# Altium project MAX274.PrjPcb
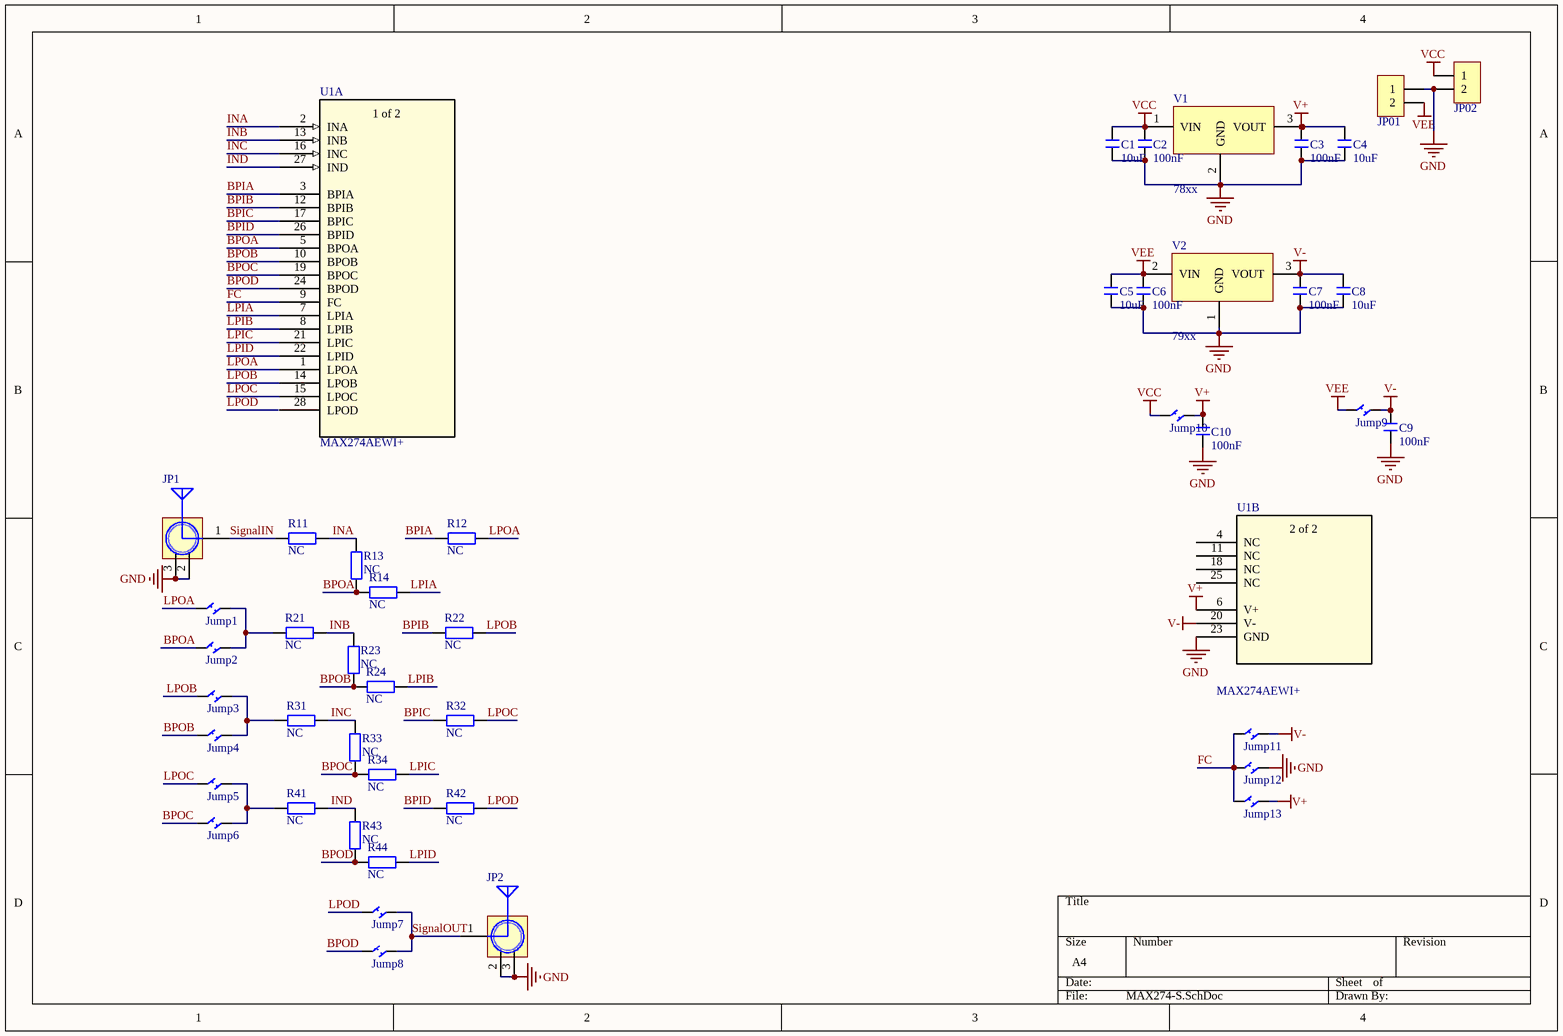
[diagram p0: MAX274-S.SchDoc]
1 sheet, 46 parts. Net scope: global (net labels, ports and power ports of the same name join across sheets).
Board file: MAX274-P.PcbDoc

## Sheet MAX274-S.SchDoc
size A4; SheetNumber: 1; SheetTotal: 1

### Parts
C1  10uF  [C 0603_L]
C2  100nF  [C 0603_L]
C3  100nF  [C 0603_L]
C4  10uF  [C 0603_L]
C5  10uF  [C 0603_L]
C6  100nF  [C 0603_L]
C7  100nF  [C 0603_L]
C8  10uF  [C 0603_L]
C9  100nF  [C 0603_L]
C10  100nF  [C 0603_L]
JP1  SMA WIFI 天线接口  [SMA-KE]  (value not drawn)
JP01  HDR-1X2  [VH3.96-LI-2P]  (value not drawn)
JP2  SMA WIFI 天线接口  [SMA-KE]  (value not drawn)
JP02  HDR-1X2  [VH3.96-LI-2P]  (value not drawn)
Jump1  JumpPad  [Jump]  (value not drawn)
Jump2  JumpPad  [Jump]  (value not drawn)
Jump3  JumpPad  [Jump]  (value not drawn)
Jump4  JumpPad  [Jump]  (value not drawn)
Jump5  JumpPad  [Jump]  (value not drawn)
Jump6  JumpPad  [Jump]  (value not drawn)
Jump7  JumpPad  [Jump]  (value not drawn)
Jump8  JumpPad  [Jump]  (value not drawn)
Jump9  JumpPad  [Jump]  (value not drawn)
Jump10  JumpPad  [Jump]  (value not drawn)
Jump11  JumpPad  [Jump]  (value not drawn)
Jump12  JumpPad  [Jump]  (value not drawn)
Jump13  JumpPad  [Jump]  (value not drawn)
R11  NC  [R 0603_L]
R12  NC  [R 0603_L]
R13  NC  [R 0603_L]
R14  NC  [R 0603_L]
R21  NC  [R 0603_L]
R22  NC  [R 0603_L]
R23  NC  [R 0603_L]
R24  NC  [R 0603_L]
R31  NC  [R 0603_L]
R32  NC  [R 0603_L]
R33  NC  [R 0603_L]
R34  NC  [R 0603_L]
R41  NC  [R 0603_L]
R42  NC  [R 0603_L]
R43  NC  [R 0603_L]
R44  NC  [R 0603_L]
U1  MAX274AEWI+  [21-0042B_28_MXM]  (parts A,B of 2)
V1  78xx  [TO252]
V2  79xx  [TO252]

### Nets
GND: C1.1 C2.1 C3.1 C4.1 C5.1 C6.1 C7.1 C8.1 C9.1 C10.1 JP01.1 JP1.2(GND) JP1.3(GND) JP2.2(GND) JP02.2 JP2.3(GND) Jump12.2 U1.23(GND) V1.2(GND) V2.1(GND)
V+: C3.2 C4.2 C10.2 Jump10.2 Jump13.2 U1.6(V+) V1.3(VOUT)
V-: C7.2 C8.2 C9.2 Jump9.2 Jump11.2 U1.20(V-) V2.3(VOUT)
VCC: C1.2 C2.2 JP02.1 Jump10.1 V1.1(VIN)
VEE: C5.2 C6.2 JP01.2 Jump9.1 V2.2(VIN)
BPIA: R12.2 U1.3(BPIA)
BPIB: R22.2 U1.12(BPIB)
BPIC: R32.2 U1.17(BPIC)
BPID: R42.2 U1.26(BPID)
BPOA: Jump2.1 R13.1 R14.2 U1.5(BPOA)
BPOB: Jump4.1 R23.1 R24.2 U1.10(BPOB)
BPOC: Jump6.1 R33.1 R34.2 U1.19(BPOC)
BPOD: Jump8.1 R43.1 R44.2 U1.24(BPOD)
FC: Jump11.1 Jump12.1 Jump13.1 U1.9(FC)
INA: R11.2 R13.2 U1.2(INA)
INB: R21.2 R23.2 U1.13(INB)
INC: R31.2 R33.2 U1.16(INC)
IND: R41.2 R43.2 U1.27(IND)
LPIA: R14.1 U1.7(LPIA)
LPIB: R24.1 U1.8(LPIB)
LPIC: R34.1 U1.21(LPIC)
LPID: R44.1 U1.22(LPID)
LPOA: Jump1.1 R12.1 U1.1(LPOA)
LPOB: Jump3.1 R22.1 U1.14(LPOB)
LPOC: Jump5.1 R32.1 U1.15(LPOC)
LPOD: Jump7.1 R42.1
SignalIN: JP1.1(ANT) R11.1
SignalOUT: JP2.1(ANT) Jump7.2 Jump8.2
NetJump1_2: Jump1.2 Jump2.2 R21.1
NetJump3_2: Jump3.2 Jump4.2 R31.1
NetJump5_2: Jump5.2 Jump6.2 R41.1

Not connected (* = marked no-connect by the designer): U1 4(NC) 11(NC) 18(NC) 25(NC) 28(LPOD)

### Notes on the sheet
- (in symbol MAX274AEWI+, part A) 1 of 2
- (in symbol MAX274AEWI+, part B) 2 of 2

### Library data of the parts
C1-C10 = C: 无极性贴片电容; 版权归属: 源创客; BOM名称: 无极性贴片电容; 学习资源: www.ooocke.com
JP1 JP2 = SMA: SMA-2.4G射频天线接口; 版权归属: 源创客; BOM名称: SMA-2.4G射频天线接口; 学习资源: www.ooocke.com
JP01 JP02 = Header 2_1: 2P接插件; 版权归属: 源创客; BOM名称: 2P接插件; 学习资源: www.ooocke.com
Jump1-Jump13 = JumpPad: 跳线焊盘
R11-R14 R21-R24 R31-R34 R41-R44 = R: 贴片电阻; 版权归属: 源创客; BOM名称: 贴片电阻; 学习资源: www.ooocke.com
U1 = MAX274AEWI+: No Description Available; Mfr_Name: Maxim Integrated Products; Copyright: Copyright (C) 2022 Ultra Librarian. All rights reserved.; Manufacturer_Part_Number: MAX274AEWI+; RefDes: RefDes; Type: DEV
V1 = 78xx: 线性稳压芯片; 版权归属: 源创客; BOM名称: 线性稳压芯片; 学习资源: www.ooocke.com
V2 = 79xx: 线性稳压芯片; 版权归属: 源创客; BOM名称: 线性稳压芯片; 学习资源: www.ooocke.com